# Altium schematic sheet FPGA.SCHDOC: FPGA Connections
size A2; Organization: Altium Limited.; Address1: Level 3, 12a Rodborough Rd; Address2: Frenchs Forest 2086; Address3: NSW; Address4: AUSTRALIA; DocumentNumber: 3; SheetNumber: 4; SheetTotal: 23; PageSetup: Record=PageOptions|CenterHorizontal=True|CenterVertical=True|PrintScale=0.71|XCorrection=1.00|YCorrection=1.00|PrintKind=0|BorderSize=5000000|LeftOffset=0|BottomOffset=0|Orientation=2|PaperLength=4199|PaperWidth=2969|Scale=100|PaperSource=7|PrintQuality=600|MediaType=1|DitherType=10|PaperKind=A3 (297 x 420 mm)|PrintScaleMode=1
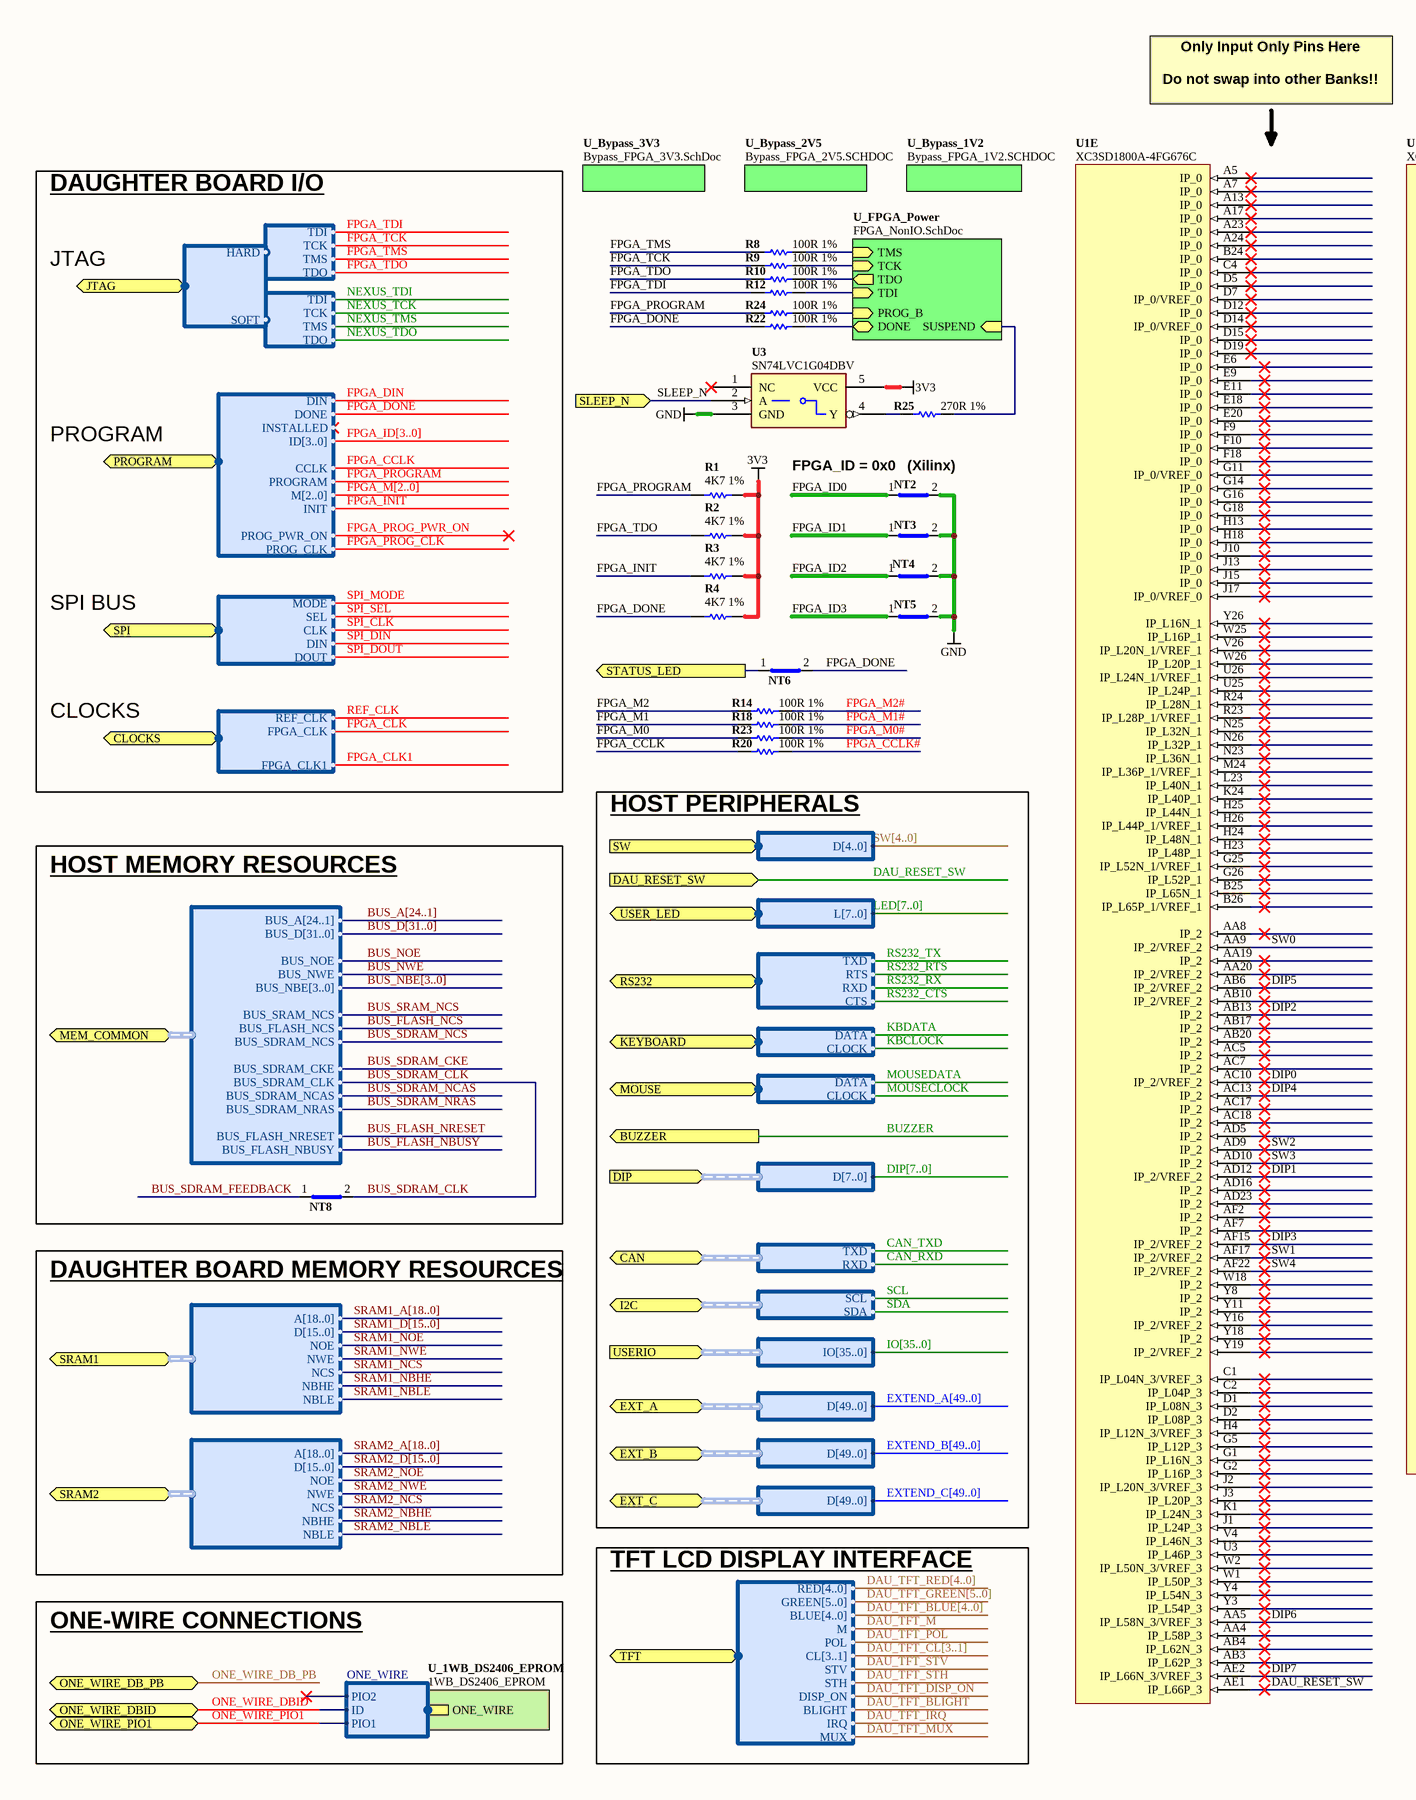
[diagram p0: FPGA.SCHDOC, left]
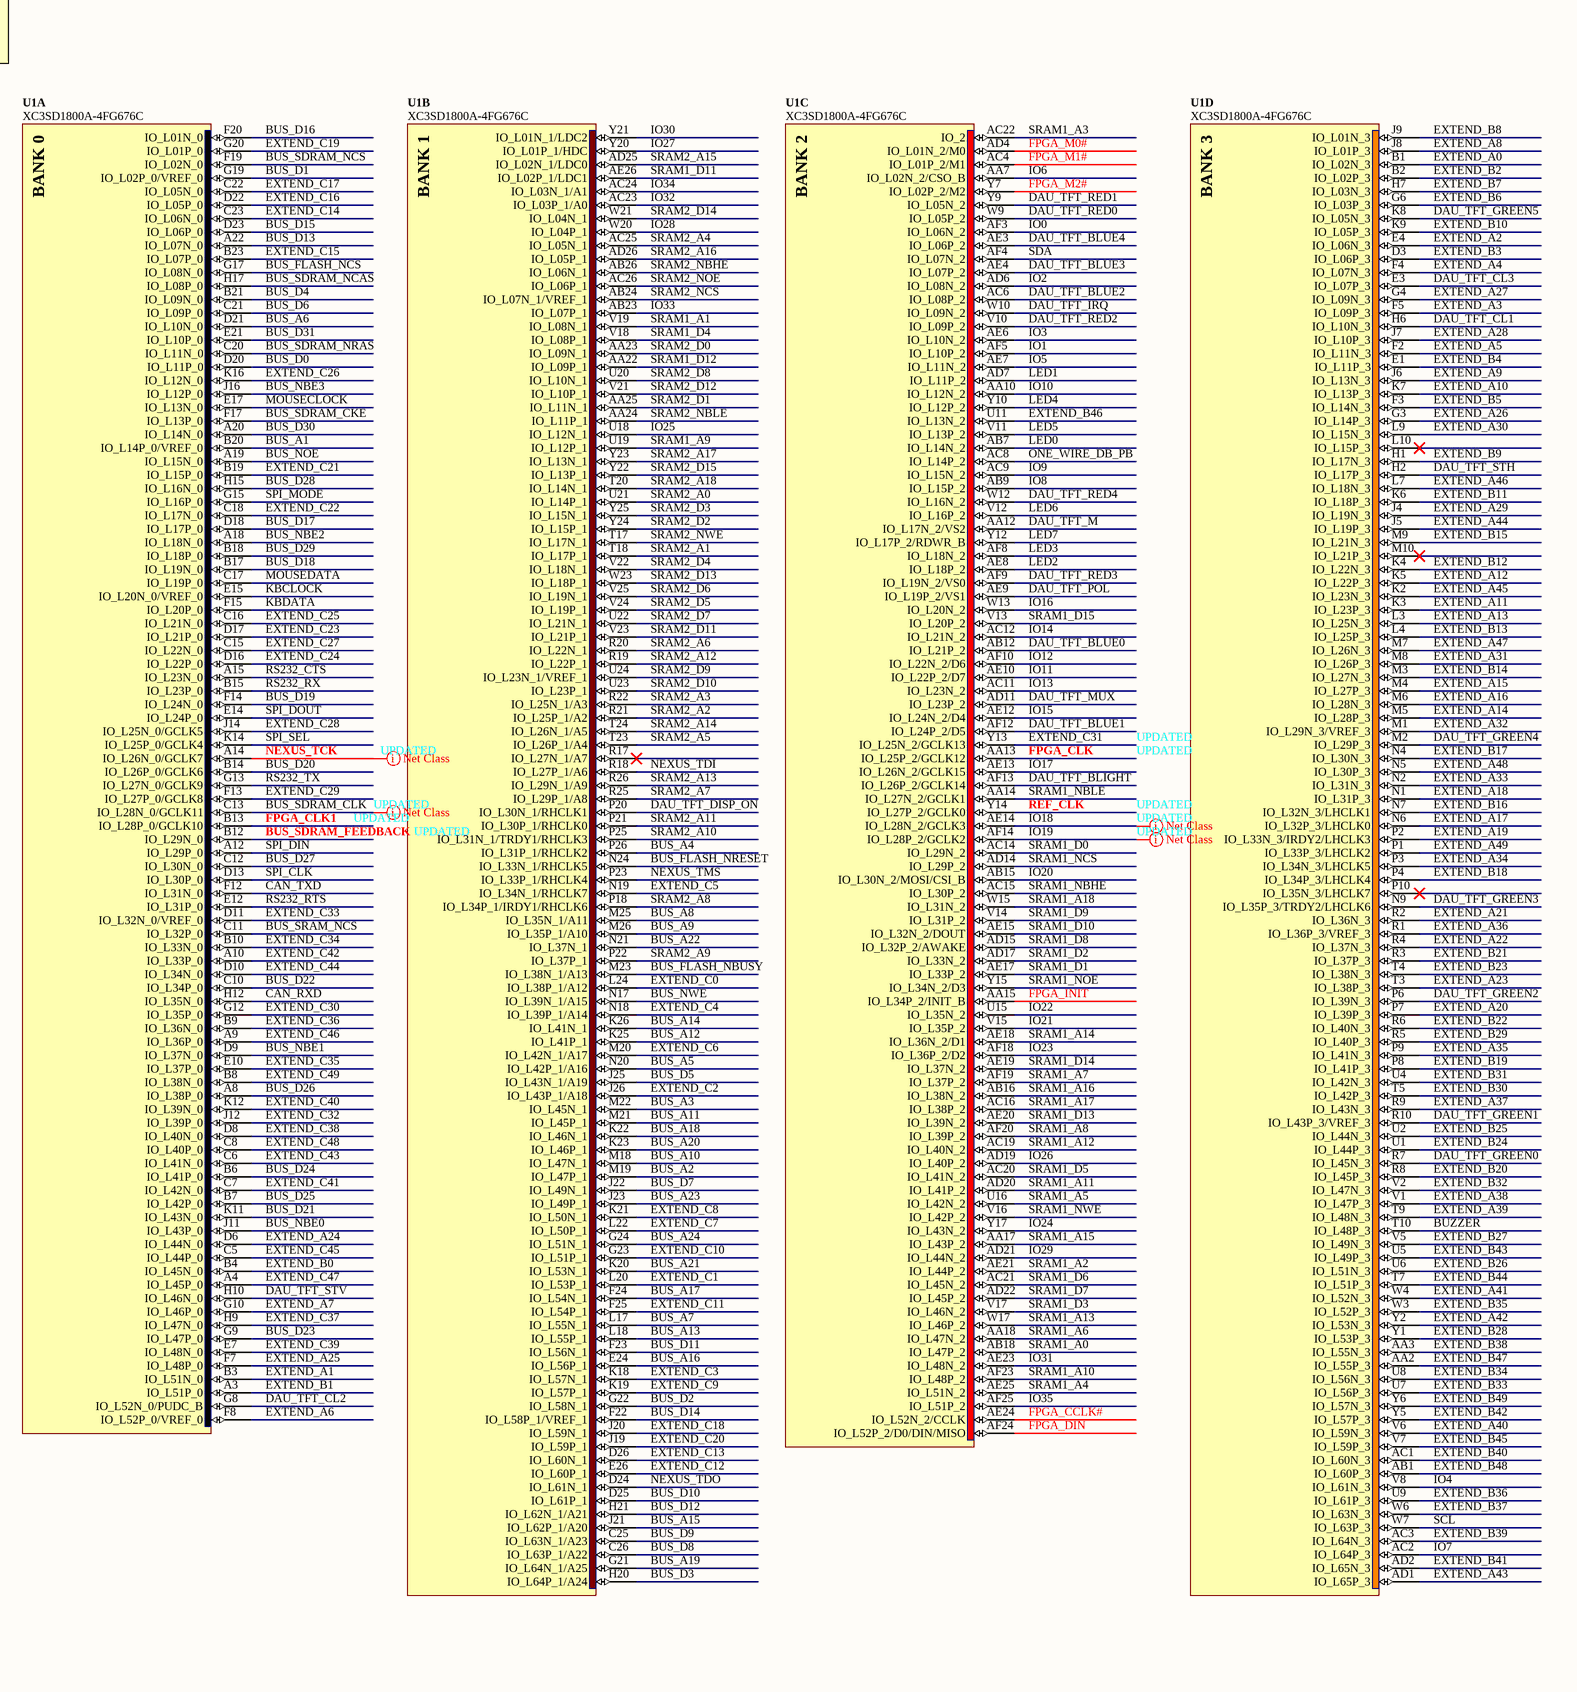
[diagram p1: FPGA.SCHDOC, right]

## Parts
NT2  Net Tie SMT2  [NETTIE-SMT2-8X8]  (value not drawn)  (net tie, no BOM)
NT3  Net Tie SMT2  [NETTIE-SMT2-8X8]  (value not drawn)  (net tie, no BOM)
NT4  Net Tie SMT2  [NETTIE-SMT2-8X8]  (value not drawn)  (net tie, no BOM)
NT5  Net Tie SMT2  [NETTIE-SMT2-8X8]  (value not drawn)  (net tie, no BOM)
NT6  Net Tie SMT2  [NETTIE-SMT2-8X8]  (value not drawn)  (net tie, no BOM)
NT8  Net Tie SMT2  [NETTIE-SMT2-8X8]  (value not drawn)  (net tie, no BOM)
R1  4K7 1%  [RESC1005-STAR]
R2  4K7 1%  [RESC1005-STAR]
R3  4K7 1%  [RESC1005-STAR]
R4  4K7 1%  [RESC1005-STAR]
R8  100R 1%  [RESC1005-STAR]
R9  100R 1%  [RESC1005-STAR]
R10  100R 1%  [RESC1005-STAR]
R12  100R 1%  [RESC1005-STAR]
R14  100R 1%  [RESC1005-STAR]
R18  100R 1%  [RESC1005-STAR]
R20  100R 1%  [RESC1005-STAR]
R22  100R 1%  [RESC1005-STAR]
R23  100R 1%  [RESC1005-STAR]
R24  100R 1%  [RESC1005-STAR]
R25  270R 1%  [RESC1005-STAR]
U1  XC3SD1800A-4FG676C  [BGA100P26X26-676]  (parts A,B,C,D,E of 8)
U3  SN74LVC1G04DBV  [SOT95P280-5]

## Blocks framed on the sheet
HOST MEMORY RESOURCES: NT8

## Sub-sheets
U_1WB_DS2406_EPROM = 1WB_DS2406_EPROM: ONE_WIRE (harness ONE_WIRE)
U_Bypass_1V2 = Bypass_FPGA_1V2.SCHDOC: no entries
U_Bypass_2V5 = Bypass_FPGA_2V5.SCHDOC: no entries
U_Bypass_3V3 = Bypass_FPGA_3V3.SchDoc: no entries
U_FPGA_Power = FPGA_NonIO.SchDoc: TMS (in), DONE (bidir), TCK (in), TDI (in), PROG_B (in), TDO (out), SUSPEND (in)

## Ports
BUZZER (out), CAN (harness CAN_INT), CLOCKS (harness DAU_CLK), DAU_RESET_SW (in), DIP (harness SW8), EXT_A (harness PBIO), EXT_B (harness PBIO), EXT_C (harness PBIO), I2C (harness I2C), JTAG (harness HARDSOFT_JTAG), KEYBOARD (harness PS2), MEM_COMMON (harness HOSTMEMORY), MOUSE (harness PS2), ONE_WIRE_DB_PB (bidir), ONE_WIRE_DBID (bidir), ONE_WIRE_PIO1 (bidir), PROGRAM (harness DAU_CTRL), RS232 (harness RS232_INT), SLEEP_N (in), SPI (harness DAU_SPI), SRAM1 (harness SRAM-256Kx16), SRAM2 (harness SRAM-256Kx16), STATUS_LED (out), SW (harness SW5), TFT (harness DAU_TFT), USER_LED (harness LED8), USERIO (harness IO36)

## Harnesses
ONE_WIRE: ID, PIO1, PIO2
SRAM-256Kx16: A[18..0], D[15..0], NCS, NWE, NOE, NBHE, NBLE
HOSTMEMORY: BUS_A[24..1], BUS_D[31..0], BUS_NOE, BUS_NWE, BUS_NBE[3..0], BUS_SRAM_NCS, BUS_FLASH_NCS, BUS_SDRAM_NCS, BUS_SDRAM_CKE, BUS_SDRAM_CLK, BUS_SDRAM_NCAS, BUS_SDRAM_NRAS, BUS_FLASH_NRESET, BUS_FLASH_NBUSY
DAU_CLK: REF_CLK, FPGA_CLK, FPGA_CLK1
DAU_SPI: MODE, SEL, CLK, DIN, DOUT
DAU_CTRL: DIN, DONE, INSTALLED, ID[3..0], CCLK, PROGRAM, M[2..0], INIT, PROG_PWR_ON, PROG_CLK
JTAG: TMS, TDO, TDI, TCK
HARDSOFT_JTAG: HARD, SOFT
LED8: L[7..0]
SW5: D[4..0]
DAU_TFT: RED[4..0], GREEN[5..0], BLUE[4..0], M, POL, CL[3..1], STV, STH, DISP_ON, BLIGHT, IRQ, MUX
PS2: DATA, CLOCK
RS232_INT: RXD, TXD, RTS, CTS
IO36: IO[35..0]
SW8: D[7..0]
CAN_INT: TXD, RXD
I2C: SCL, SDA
PBIO: D[49..0]

## Nets
3V3: R1.2 R2.2 R3.2 R4.2 U3.5(VCC)
GND: NT2.2(Net2) NT3.2(Net2) NT4.2(Net2) NT5.2(Net2) U3.3(GND)
BUS_A1: U1.B20(IO_L14P_0/VREF_0)
BUS_A2: U1.M19(IO_L47P_1)
BUS_A3: U1.M22(IO_L45N_1)
BUS_A4: U1.P26(IO_L31P_1/RHCLK2)
BUS_A5: U1.N20(IO_L42P_1/A16)
BUS_A6: U1.D21(IO_L10N_0)
BUS_A7: U1.L17(IO_L55N_1)
BUS_A8: U1.M25(IO_L35N_1/A11)
BUS_A9: U1.M26(IO_L35P_1/A10)
BUS_A10: U1.M18(IO_L47N_1)
BUS_A11: U1.M21(IO_L45P_1)
BUS_A12: U1.K25(IO_L41P_1)
BUS_A13: U1.L18(IO_L55P_1)
BUS_A14: U1.K26(IO_L41N_1)
BUS_A15: U1.J21(IO_L62P_1/A20)
BUS_A16: U1.E24(IO_L56P_1)
BUS_A17: U1.F24(IO_L54N_1)
BUS_A18: U1.K22(IO_L46N_1)
BUS_A19: U1.G21(IO_L64N_1/A25)
BUS_A20: U1.K23(IO_L46P_1)
BUS_A21: U1.K20(IO_L53N_1)
BUS_A22: U1.N21(IO_L37N_1)
BUS_A23: U1.J23(IO_L49P_1)
BUS_A24: U1.G24(IO_L51N_1)
BUS_D0: U1.D20(IO_L11P_0)
BUS_D1: U1.G19(IO_L02P_0/VREF_0)
BUS_D2: U1.G22(IO_L58N_1)
BUS_D3: U1.H20(IO_L64P_1/A24)
BUS_D4: U1.B21(IO_L09N_0)
BUS_D5: U1.J25(IO_L43N_1/A19)
BUS_D6: U1.C21(IO_L09P_0)
BUS_D7: U1.J22(IO_L49N_1)
BUS_D8: U1.C26(IO_L63P_1/A22)
BUS_D9: U1.C25(IO_L63N_1/A23)
BUS_D10: U1.D25(IO_L61P_1)
BUS_D11: U1.F23(IO_L56N_1)
BUS_D12: U1.H21(IO_L62N_1/A21)
BUS_D13: U1.A22(IO_L07N_0)
BUS_D14: U1.F22(IO_L58P_1/VREF_1)
BUS_D15: U1.D23(IO_L06P_0)
BUS_D16: U1.F20(IO_L01N_0)
BUS_D17: U1.D18(IO_L17P_0)
BUS_D18: U1.B17(IO_L19N_0)
BUS_D19: U1.F14(IO_L24N_0)
BUS_D20: U1.B14(IO_L26P_0/GCLK6)
BUS_D21: U1.K11(IO_L43N_0)
BUS_D22: U1.C10(IO_L34P_0)
BUS_D23: U1.G9(IO_L47P_0)
BUS_D24: U1.B6(IO_L41P_0)
BUS_D25: U1.B7(IO_L42P_0)
BUS_D26: U1.A8(IO_L38P_0)
BUS_D27: U1.C12(IO_L30N_0)
BUS_D28: U1.H15(IO_L16N_0)
BUS_D29: U1.B18(IO_L18P_0)
BUS_D30: U1.A20(IO_L14N_0)
BUS_D31: U1.E21(IO_L10P_0)
BUS_FLASH_NBUSY: U1.M23(IO_L38N_1/A13) ; port MEM_COMMON.BUS_FLASH_NBUSY
BUS_FLASH_NCS: U1.G17(IO_L08N_0) ; port MEM_COMMON.BUS_FLASH_NCS
BUS_FLASH_NRESET: U1.N24(IO_L33N_1/RHCLK5) ; port MEM_COMMON.BUS_FLASH_NRESET
BUS_NBE0: U1.J11(IO_L43P_0)
BUS_NBE1: U1.D9(IO_L37N_0)
BUS_NBE2: U1.A18(IO_L18N_0)
BUS_NBE3: U1.J16(IO_L12P_0)
BUS_NOE: U1.A19(IO_L15N_0) ; port MEM_COMMON.BUS_NOE
BUS_NWE: U1.N17(IO_L39N_1/A15) ; port MEM_COMMON.BUS_NWE
BUS_SDRAM_CKE: U1.F17(IO_L13P_0) ; port MEM_COMMON.BUS_SDRAM_CKE
BUS_SDRAM_CLK: NT8.2(Net2) U1.C13(IO_L28N_0/GCLK11) ; port MEM_COMMON.BUS_SDRAM_CLK
BUS_SDRAM_FEEDBACK: NT8.1(Net1) U1.B12(IO_L29N_0)
BUS_SDRAM_NCAS: U1.H17(IO_L08P_0) ; port MEM_COMMON.BUS_SDRAM_NCAS
BUS_SDRAM_NCS: U1.F19(IO_L02N_0) ; port MEM_COMMON.BUS_SDRAM_NCS
BUS_SDRAM_NRAS: U1.C20(IO_L11N_0) ; port MEM_COMMON.BUS_SDRAM_NRAS
BUS_SRAM_NCS: U1.C11(IO_L32P_0) ; port MEM_COMMON.BUS_SRAM_NCS
BUZZER: U1.T10(IO_L48P_3) ; port BUZZER
CAN_RXD: U1.H12(IO_L35N_0) ; port CAN.RXD
CAN_TXD: U1.F12(IO_L31N_0) ; port CAN.TXD
DAU_RESET_SW: U1.AE1(IP_L66P_3) ; port DAU_RESET_SW
DAU_TFT_BLIGHT: U1.AF13(IO_L26P_2/GCLK14) ; port TFT.BLIGHT
DAU_TFT_BLUE0: U1.AB12(IO_L21P_2)
DAU_TFT_BLUE1: U1.AF12(IO_L24P_2/D5)
DAU_TFT_BLUE2: U1.AC6(IO_L08P_2)
DAU_TFT_BLUE3: U1.AE4(IO_L07P_2)
DAU_TFT_BLUE4: U1.AE3(IO_L06P_2)
DAU_TFT_CL1: U1.H6(IO_L10N_3)
DAU_TFT_CL2: U1.G8(IO_L52N_0/PUDC_B)
DAU_TFT_CL3: U1.E3(IO_L07P_3)
DAU_TFT_DISP_ON: U1.P20(IO_L30N_1/RHCLK1) ; port TFT.DISP_ON
DAU_TFT_GREEN0: U1.R7(IO_L45N_3)
DAU_TFT_GREEN1: U1.R10(IO_L43P_3/VREF_3)
DAU_TFT_GREEN2: U1.P6(IO_L39N_3)
DAU_TFT_GREEN3: U1.N9(IO_L35P_3/TRDY2/LHCLK6)
DAU_TFT_GREEN4: U1.M2(IO_L29P_3)
DAU_TFT_GREEN5: U1.K8(IO_L05N_3)
DAU_TFT_IRQ: U1.W10(IO_L09N_2) ; port TFT.IRQ
DAU_TFT_M: U1.AA12(IO_L17N_2/VS2) ; port TFT.M
DAU_TFT_MUX: U1.AD11(IO_L23P_2) ; port TFT.MUX
DAU_TFT_POL: U1.AE9(IO_L19P_2/VS1) ; port TFT.POL
DAU_TFT_RED0: U1.W9(IO_L05P_2)
DAU_TFT_RED1: U1.Y9(IO_L05N_2)
DAU_TFT_RED2: U1.V10(IO_L09P_2)
DAU_TFT_RED3: U1.AF9(IO_L19N_2/VS0)
DAU_TFT_RED4: U1.W12(IO_L16N_2)
DAU_TFT_STH: U1.H2(IO_L17P_3) ; port TFT.STH
DAU_TFT_STV: U1.H10(IO_L46N_0) ; port TFT.STV
DIP0: U1.AC10(IP_2/VREF_2)
DIP1: U1.AD12(IP_2/VREF_2)
DIP2: U1.AB13(IP_2)
DIP3: U1.AF15(IP_2/VREF_2)
DIP4: U1.AC13(IP_2)
DIP5: U1.AB6(IP_2/VREF_2)
DIP6: U1.AA5(IP_L58N_3/VREF_3)
DIP7: U1.AE2(IP_L66N_3/VREF_3)
EXTEND_A0: U1.B1(IO_L02N_3)
EXTEND_A1: U1.B3(IO_L51N_0)
EXTEND_A2: U1.E4(IO_L06N_3)
EXTEND_A3: U1.F5(IO_L09P_3)
EXTEND_A4: U1.F4(IO_L07N_3)
EXTEND_A5: U1.F2(IO_L11N_3)
EXTEND_A6: U1.F8(IO_L52P_0/VREF_0)
EXTEND_A7: U1.G10(IO_L46P_0)
EXTEND_A8: U1.J8(IO_L01P_3)
EXTEND_A9: U1.J6(IO_L13N_3)
EXTEND_A10: U1.K7(IO_L13P_3)
EXTEND_A11: U1.K3(IO_L23P_3)
EXTEND_A12: U1.K5(IO_L22P_3)
EXTEND_A13: U1.L3(IO_L25N_3)
EXTEND_A14: U1.M5(IO_L28P_3)
EXTEND_A15: U1.M4(IO_L27P_3)
EXTEND_A16: U1.M6(IO_L28N_3)
EXTEND_A17: U1.N6(IO_L32P_3/LHCLK0)
EXTEND_A18: U1.N1(IO_L31P_3)
EXTEND_A19: U1.P2(IO_L33N_3/IRDY2/LHCLK3)
EXTEND_A20: U1.P7(IO_L39P_3)
EXTEND_A21: U1.R2(IO_L36N_3)
EXTEND_A22: U1.R4(IO_L37N_3)
EXTEND_A23: U1.T3(IO_L38P_3)
EXTEND_A24: U1.D6(IO_L44N_0)
EXTEND_A25: U1.F7(IO_L48P_0)
EXTEND_A26: U1.G3(IO_L14P_3)
EXTEND_A27: U1.G4(IO_L09N_3)
EXTEND_A28: U1.J7(IO_L10P_3)
EXTEND_A29: U1.J4(IO_L19N_3)
EXTEND_A30: U1.L9(IO_L15N_3)
EXTEND_A31: U1.M8(IO_L26P_3)
EXTEND_A32: U1.M1(IO_L29N_3/VREF_3)
EXTEND_A33: U1.N2(IO_L31N_3)
EXTEND_A34: U1.P3(IO_L34N_3/LHCLK5)
EXTEND_A35: U1.P9(IO_L41N_3)
EXTEND_A36: U1.R1(IO_L36P_3/VREF_3)
EXTEND_A37: U1.R9(IO_L43N_3)
EXTEND_A38: U1.V1(IO_L47P_3)
EXTEND_A39: U1.T9(IO_L48N_3)
EXTEND_A40: U1.V6(IO_L59N_3)
EXTEND_A41: U1.W4(IO_L52N_3)
EXTEND_A42: U1.Y2(IO_L53N_3)
EXTEND_A43: U1.AD1(IO_L65P_3)
EXTEND_A44: U1.J5(IO_L19P_3)
EXTEND_A45: U1.K2(IO_L23N_3)
EXTEND_A46: U1.L7(IO_L18N_3)
EXTEND_A47: U1.M7(IO_L26N_3)
EXTEND_A48: U1.N5(IO_L30P_3)
EXTEND_A49: U1.P1(IO_L33P_3/LHCLK2)
EXTEND_B0: U1.B4(IO_L45N_0)
EXTEND_B1: U1.A3(IO_L51P_0)
EXTEND_B2: U1.B2(IO_L02P_3)
EXTEND_B3: U1.D3(IO_L06P_3)
EXTEND_B4: U1.E1(IO_L11P_3)
EXTEND_B5: U1.F3(IO_L14N_3)
EXTEND_B6: U1.G6(IO_L03P_3)
EXTEND_B7: U1.H7(IO_L03N_3)
EXTEND_B8: U1.J9(IO_L01N_3)
EXTEND_B9: U1.H1(IO_L17N_3)
EXTEND_B10: U1.K9(IO_L05P_3)
EXTEND_B11: U1.K6(IO_L18P_3)
EXTEND_B12: U1.K4(IO_L22N_3)
EXTEND_B13: U1.L4(IO_L25P_3)
EXTEND_B14: U1.M3(IO_L27N_3)
EXTEND_B15: U1.M9(IO_L21N_3)
EXTEND_B16: U1.N7(IO_L32N_3/LHCLK1)
EXTEND_B17: U1.N4(IO_L30N_3)
EXTEND_B18: U1.P4(IO_L34P_3/LHCLK4)
EXTEND_B19: U1.P8(IO_L41P_3)
EXTEND_B20: U1.R8(IO_L45P_3)
EXTEND_B21: U1.R3(IO_L37P_3)
EXTEND_B22: U1.R6(IO_L40N_3)
EXTEND_B23: U1.T4(IO_L38N_3)
EXTEND_B24: U1.U1(IO_L44P_3)
EXTEND_B25: U1.U2(IO_L44N_3)
EXTEND_B26: U1.U6(IO_L51N_3)
EXTEND_B27: U1.V5(IO_L49N_3)
EXTEND_B28: U1.Y1(IO_L53P_3)
EXTEND_B29: U1.R5(IO_L40P_3)
EXTEND_B30: U1.T5(IO_L42P_3)
EXTEND_B31: U1.U4(IO_L42N_3)
EXTEND_B32: U1.V2(IO_L47N_3)
EXTEND_B33: U1.U7(IO_L56P_3)
EXTEND_B34: U1.U8(IO_L56N_3)
EXTEND_B35: U1.W3(IO_L52P_3)
EXTEND_B36: U1.U9(IO_L61P_3)
EXTEND_B37: U1.W6(IO_L63N_3)
EXTEND_B38: U1.AA3(IO_L55N_3)
EXTEND_B39: U1.AC3(IO_L64N_3)
EXTEND_B40: U1.AC1(IO_L60N_3)
EXTEND_B41: U1.AD2(IO_L65N_3)
EXTEND_B42: U1.Y5(IO_L57P_3)
EXTEND_B43: U1.U5(IO_L49P_3)
EXTEND_B44: U1.T7(IO_L51P_3)
EXTEND_B45: U1.V7(IO_L59P_3)
EXTEND_B46: U1.U11(IO_L13N_2)
EXTEND_B47: U1.AA2(IO_L55P_3)
EXTEND_B48: U1.AB1(IO_L60P_3)
EXTEND_B49: U1.Y6(IO_L57N_3)
EXTEND_C0: U1.L24(IO_L38P_1/A12)
EXTEND_C1: U1.L20(IO_L53P_1)
EXTEND_C2: U1.J26(IO_L43P_1/A18)
EXTEND_C3: U1.K18(IO_L57N_1)
EXTEND_C4: U1.N18(IO_L39P_1/A14)
EXTEND_C5: U1.N19(IO_L34N_1/RHCLK7)
EXTEND_C6: U1.M20(IO_L42N_1/A17)
EXTEND_C7: U1.L22(IO_L50P_1)
EXTEND_C8: U1.K21(IO_L50N_1)
EXTEND_C9: U1.K19(IO_L57P_1)
EXTEND_C10: U1.G23(IO_L51P_1)
EXTEND_C11: U1.F25(IO_L54P_1)
EXTEND_C12: U1.E26(IO_L60P_1)
EXTEND_C13: U1.D26(IO_L60N_1)
EXTEND_C14: U1.C23(IO_L06N_0)
EXTEND_C15: U1.B23(IO_L07P_0)
EXTEND_C16: U1.D22(IO_L05P_0)
EXTEND_C17: U1.C22(IO_L05N_0)
EXTEND_C18: U1.J20(IO_L59N_1)
EXTEND_C19: U1.G20(IO_L01P_0)
EXTEND_C20: U1.J19(IO_L59P_1)
EXTEND_C21: U1.B19(IO_L15P_0)
EXTEND_C22: U1.C18(IO_L17N_0)
EXTEND_C23: U1.D17(IO_L21P_0)
EXTEND_C24: U1.D16(IO_L22P_0)
EXTEND_C25: U1.C16(IO_L21N_0)
EXTEND_C26: U1.K16(IO_L12N_0)
EXTEND_C27: U1.C15(IO_L22N_0)
EXTEND_C28: U1.J14(IO_L25N_0/GCLK5)
EXTEND_C29: U1.F13(IO_L27P_0/GCLK8)
EXTEND_C30: U1.G12(IO_L35P_0)
EXTEND_C31: U1.Y13(IO_L25N_2/GCLK13)
EXTEND_C32: U1.J12(IO_L39P_0)
EXTEND_C33: U1.D11(IO_L32N_0/VREF_0)
EXTEND_C34: U1.B10(IO_L33N_0)
EXTEND_C35: U1.E10(IO_L37P_0)
EXTEND_C36: U1.B9(IO_L36N_0)
EXTEND_C37: U1.H9(IO_L47N_0)
EXTEND_C38: U1.D8(IO_L40N_0)
EXTEND_C39: U1.E7(IO_L48N_0)
EXTEND_C40: U1.K12(IO_L39N_0)
EXTEND_C41: U1.C7(IO_L42N_0)
EXTEND_C42: U1.A10(IO_L33P_0)
EXTEND_C43: U1.C6(IO_L41N_0)
EXTEND_C44: U1.D10(IO_L34N_0)
EXTEND_C45: U1.C5(IO_L44P_0)
EXTEND_C46: U1.A9(IO_L36P_0)
EXTEND_C47: U1.A4(IO_L45P_0)
EXTEND_C48: U1.C8(IO_L40P_0)
EXTEND_C49: U1.B8(IO_L38N_0)
FPGA_CCLK: R20.1 ; port PROGRAM.CCLK
FPGA_CCLK#: R20.2 U1.AE24(IO_L52N_2/CCLK)
FPGA_CLK: U1.AA13(IO_L25P_2/GCLK12) ; port CLOCKS.FPGA_CLK
FPGA_CLK1: U1.B13(IO_L28P_0/GCLK10) ; port CLOCKS.FPGA_CLK1
FPGA_DIN: U1.AF24(IO_L52P_2/D0/DIN/MISO) ; port PROGRAM.DIN
FPGA_DONE: NT6.2(Net2) R4.1 R22.1 ; port PROGRAM.DONE
FPGA_ID0: NT2.1(Net1)
FPGA_ID1: NT3.1(Net1)
FPGA_ID2: NT4.1(Net1)
FPGA_ID3: NT5.1(Net1)
FPGA_INIT: R3.1 U1.AA15(IO_L34P_2/INIT_B) ; port PROGRAM.INIT
FPGA_M0: R23.1
FPGA_M0#: R23.2 U1.AD4(IO_L01N_2/M0)
FPGA_M1: R18.1
FPGA_M1#: R18.2 U1.AC4(IO_L01P_2/M1)
FPGA_M2: R14.1
FPGA_M2#: R14.2 U1.Y7(IO_L02P_2/M2)
FPGA_PROG_CLK: port PROGRAM.PROG_CLK
FPGA_PROG_PWR_ON: port PROGRAM.PROG_PWR_ON
FPGA_PROGRAM: R1.1 R24.1 ; port PROGRAM.PROGRAM
FPGA_TCK: R9.1 ; harness JTAG.TCK
FPGA_TDI: R12.1 ; harness JTAG.TDI
FPGA_TDO: R2.1 R10.1 ; harness JTAG.TDO
FPGA_TMS: R8.1 ; harness JTAG.TMS
IO0: U1.AF3(IO_L06N_2)
IO1: U1.AF5(IO_L10P_2)
IO2: U1.AD6(IO_L08N_2)
IO3: U1.AE6(IO_L10N_2)
IO4: U1.V8(IO_L61N_3)
IO5: U1.AE7(IO_L11N_2)
IO6: U1.AA7(IO_L02N_2/CSO_B)
IO7: U1.AC2(IO_L64P_3)
IO8: U1.AB9(IO_L15P_2)
IO9: U1.AC9(IO_L15N_2)
IO10: U1.AA10(IO_L12N_2)
IO11: U1.AE10(IO_L22P_2/D7)
IO12: U1.AF10(IO_L22N_2/D6)
IO13: U1.AC11(IO_L23N_2)
IO14: U1.AC12(IO_L21N_2)
IO15: U1.AE12(IO_L24N_2/D4)
IO16: U1.W13(IO_L20N_2)
IO17: U1.AE13(IO_L26N_2/GCLK15)
IO18: U1.AE14(IO_L28N_2/GCLK3)
IO19: U1.AF14(IO_L28P_2/GCLK2)
IO20: U1.AB15(IO_L30N_2/MOSI/CSI_B)
IO21: U1.V15(IO_L35P_2)
IO22: U1.U15(IO_L35N_2)
IO23: U1.AF18(IO_L36P_2/D2)
IO24: U1.Y17(IO_L43N_2)
IO25: U1.U18(IO_L12N_1)
IO26: U1.AD19(IO_L40P_2)
IO27: U1.Y20(IO_L01P_1/HDC)
IO28: U1.W20(IO_L04P_1)
IO29: U1.AD21(IO_L44N_2)
IO30: U1.Y21(IO_L01N_1/LDC2)
IO31: U1.AE23(IO_L48N_2)
IO32: U1.AC23(IO_L03P_1/A0)
IO33: U1.AB23(IO_L07P_1)
IO34: U1.AC24(IO_L03N_1/A1)
IO35: U1.AF25(IO_L51P_2)
KBCLOCK: U1.E15(IO_L20N_0/VREF_0) ; port KEYBOARD.CLOCK
KBDATA: U1.F15(IO_L20P_0) ; port KEYBOARD.DATA
LED0: U1.AB7(IO_L14N_2)
LED1: U1.AD7(IO_L11P_2)
LED2: U1.AE8(IO_L18P_2)
LED3: U1.AF8(IO_L18N_2)
LED4: U1.Y10(IO_L12P_2)
LED5: U1.V11(IO_L13P_2)
LED6: U1.V12(IO_L16P_2)
LED7: U1.Y12(IO_L17P_2/RDWR_B)
MOUSECLOCK: U1.E17(IO_L13N_0) ; port MOUSE.CLOCK
MOUSEDATA: U1.C17(IO_L19P_0) ; port MOUSE.DATA
NEXUS_TCK: U1.A14(IO_L26N_0/GCLK7) ; harness JTAG.TCK
NEXUS_TDI: U1.R18(IO_L27P_1/A6) ; harness JTAG.TDI
NEXUS_TDO: U1.D24(IO_L61N_1) ; harness JTAG.TDO
NEXUS_TMS: U1.P23(IO_L33P_1/RHCLK4) ; harness JTAG.TMS
ONE_WIRE_DB_PB: U1.AC8(IO_L14P_2) ; port ONE_WIRE_DB_PB
ONE_WIRE_DBID: port ONE_WIRE_DBID, sheet U_1WB_DS2406_EPROM/ONE_WIRE.ID
ONE_WIRE_PIO1: port ONE_WIRE_PIO1, sheet U_1WB_DS2406_EPROM/ONE_WIRE.PIO1
REF_CLK: U1.Y14(IO_L27P_2/GCLK0) ; port CLOCKS.REF_CLK
RS232_CTS: U1.A15(IO_L23N_0) ; port RS232.CTS
RS232_RTS: U1.E12(IO_L31P_0) ; port RS232.RTS
RS232_RX: U1.B15(IO_L23P_0) ; port RS232.RXD
RS232_TX: U1.G13(IO_L27N_0/GCLK9) ; port RS232.TXD
SCL: U1.W7(IO_L63P_3) ; port I2C.SCL
SDA: U1.AF4(IO_L07N_2) ; port I2C.SDA
SLEEP_N: U3.2(A) ; port SLEEP_N
SPI_CLK: U1.D13(IO_L30P_0) ; port SPI.CLK
SPI_DIN: U1.A12(IO_L29P_0) ; port SPI.DIN
SPI_DOUT: U1.E14(IO_L24P_0) ; port SPI.DOUT
SPI_MODE: U1.G15(IO_L16P_0) ; port SPI.MODE
SPI_SEL: U1.K14(IO_L25P_0/GCLK4) ; port SPI.SEL
SRAM1_A0: U1.AB18(IO_L47P_2)
SRAM1_A1: U1.V19(IO_L08N_1)
SRAM1_A2: U1.AE21(IO_L44P_2)
SRAM1_A3: U1.AC22(IO_2)
SRAM1_A4: U1.AE25(IO_L51N_2)
SRAM1_A5: U1.U16(IO_L42N_2)
SRAM1_A6: U1.AA18(IO_L47N_2)
SRAM1_A7: U1.AF19(IO_L37P_2)
SRAM1_A8: U1.AF20(IO_L39P_2)
SRAM1_A9: U1.U19(IO_L12P_1)
SRAM1_A10: U1.AF23(IO_L48P_2)
SRAM1_A11: U1.AD20(IO_L41P_2)
SRAM1_A12: U1.AC19(IO_L40N_2)
SRAM1_A13: U1.W17(IO_L46P_2)
SRAM1_A14: U1.AE18(IO_L36N_2/D1)
SRAM1_A15: U1.AA17(IO_L43P_2)
SRAM1_A16: U1.AB16(IO_L38N_2)
SRAM1_A17: U1.AC16(IO_L38P_2)
SRAM1_A18: U1.W15(IO_L31N_2)
SRAM1_D0: U1.AC14(IO_L29N_2)
SRAM1_D1: U1.AE17(IO_L33P_2)
SRAM1_D2: U1.AD17(IO_L33N_2)
SRAM1_D3: U1.V17(IO_L46N_2)
SRAM1_D4: U1.V18(IO_L08P_1)
SRAM1_D5: U1.AC20(IO_L41N_2)
SRAM1_D6: U1.AC21(IO_L45N_2)
SRAM1_D7: U1.AD22(IO_L45P_2)
SRAM1_D8: U1.AD15(IO_L32P_2/AWAKE)
SRAM1_D9: U1.V14(IO_L31P_2)
SRAM1_D10: U1.AE15(IO_L32N_2/DOUT)
SRAM1_D11: U1.AE26(IO_L02P_1/LDC1)
SRAM1_D12: U1.AA22(IO_L09P_1)
SRAM1_D13: U1.AE20(IO_L39N_2)
SRAM1_D14: U1.AE19(IO_L37N_2)
SRAM1_D15: U1.V13(IO_L20P_2)
SRAM1_NBHE: U1.AC15(IO_L30P_2) ; port SRAM1.NBHE
SRAM1_NBLE: U1.AA14(IO_L27N_2/GCLK1) ; port SRAM1.NBLE
SRAM1_NCS: U1.AD14(IO_L29P_2) ; port SRAM1.NCS
SRAM1_NOE: U1.Y15(IO_L34N_2/D3) ; port SRAM1.NOE
SRAM1_NWE: U1.V16(IO_L42P_2) ; port SRAM1.NWE
SRAM2_A0: U1.U21(IO_L14P_1)
SRAM2_A1: U1.T18(IO_L17P_1)
SRAM2_A2: U1.R21(IO_L25P_1/A2)
SRAM2_A3: U1.R22(IO_L25N_1/A3)
SRAM2_A4: U1.AC25(IO_L05N_1)
SRAM2_A5: U1.T23(IO_L26P_1/A4)
SRAM2_A6: U1.R20(IO_L22N_1)
SRAM2_A7: U1.R25(IO_L29P_1/A8)
SRAM2_A8: U1.P18(IO_L34P_1/IRDY1/RHCLK6)
SRAM2_A9: U1.P22(IO_L37P_1)
SRAM2_A10: U1.P25(IO_L31N_1/TRDY1/RHCLK3)
SRAM2_A11: U1.P21(IO_L30P_1/RHCLK0)
SRAM2_A12: U1.R19(IO_L22P_1)
SRAM2_A13: U1.R26(IO_L29N_1/A9)
SRAM2_A14: U1.T24(IO_L26N_1/A5)
SRAM2_A15: U1.AD25(IO_L02N_1/LDC0)
SRAM2_A16: U1.AD26(IO_L05P_1)
SRAM2_A17: U1.Y23(IO_L13N_1)
SRAM2_A18: U1.T20(IO_L14N_1)
SRAM2_D0: U1.AA23(IO_L09N_1)
SRAM2_D1: U1.AA25(IO_L11N_1)
SRAM2_D2: U1.Y24(IO_L15P_1)
SRAM2_D3: U1.Y25(IO_L15N_1)
SRAM2_D4: U1.V22(IO_L18N_1)
SRAM2_D5: U1.V24(IO_L19P_1)
SRAM2_D6: U1.V25(IO_L19N_1)
SRAM2_D7: U1.U22(IO_L21N_1)
SRAM2_D8: U1.U20(IO_L10N_1)
SRAM2_D9: U1.U24(IO_L23N_1/VREF_1)
SRAM2_D10: U1.U23(IO_L23P_1)
SRAM2_D11: U1.V23(IO_L21P_1)
SRAM2_D12: U1.V21(IO_L10P_1)
SRAM2_D13: U1.W23(IO_L18P_1)
SRAM2_D14: U1.W21(IO_L04N_1)
SRAM2_D15: U1.Y22(IO_L13P_1)
SRAM2_NBHE: U1.AB26(IO_L06N_1) ; port SRAM2.NBHE
SRAM2_NBLE: U1.AA24(IO_L11P_1) ; port SRAM2.NBLE
SRAM2_NCS: U1.AB24(IO_L07N_1/VREF_1) ; port SRAM2.NCS
SRAM2_NOE: U1.AC26(IO_L06P_1) ; port SRAM2.NOE
SRAM2_NWE: U1.T17(IO_L17N_1) ; port SRAM2.NWE
STATUS_LED: NT6.1(Net1) ; port STATUS_LED
SW0: U1.AA9(IP_2/VREF_2)
SW1: U1.AF17(IP_2/VREF_2)
SW2: U1.AD9(IP_2)
SW3: U1.AD10(IP_2)
SW4: U1.AF22(IP_2/VREF_2)
NetR8_2: R8.2 ; sheet U_FPGA_Power/TMS
NetR9_2: R9.2 ; sheet U_FPGA_Power/TCK
NetR10_2: R10.2 ; sheet U_FPGA_Power/TDO
NetR12_2: R12.2 ; sheet U_FPGA_Power/TDI
NetR22_2: R22.2 ; sheet U_FPGA_Power/DONE
NetR24_2: R24.2 ; sheet U_FPGA_Power/PROG_B
NetR25_1: R25.1 U3.4(Y)
NetR25_2: R25.2 ; sheet U_FPGA_Power/SUSPEND

Not connected (* = marked no-connect by the designer): U1 A5(IP_0)* A7(IP_0)* A13(IP_0)* A17(IP_0)* A23(IP_0)* A24(IP_0)* AA4(IP_L58P_3)* AA8(IP_2)* AA19(IP_2)* AA20(IP_2/VREF_2)* AB3(IP_L62P_3)* AB4(IP_L62N_3)* AB10(IP_2/VREF_2)* AB17(IP_2)* AB20(IP_2)* AC5(IP_2)* AC7(IP_2)* AC17(IP_2)* AC18(IP_2)* AD5(IP_2)* AD16(IP_2)* AD23(IP_2)* AF2(IP_2)* AF7(IP_2)* B24(IP_0)* B25(IP_L65N_1)* B26(IP_L65P_1/VREF_1)* C1(IP_L04N_3/VREF_3)* C2(IP_L04P_3)* C4(IP_0)* D1(IP_L08N_3)* D2(IP_L08P_3)* D5(IP_0)* D7(IP_0/VREF_0)* D12(IP_0)* D14(IP_0/VREF_0)* D15(IP_0)* D19(IP_0)* E6(IP_0)* E9(IP_0)* E11(IP_0)* E18(IP_0)* E20(IP_0)* F9(IP_0)* F10(IP_0)* F18(IP_0)* G1(IP_L16N_3)* G2(IP_L16P_3)* G5(IP_L12P_3)* G11(IP_0/VREF_0)* G14(IP_0)* G16(IP_0)* G18(IP_0)* G25(IP_L52N_1/VREF_1)* G26(IP_L52P_1)* H4(IP_L12N_3/VREF_3)* H13(IP_0)* H18(IP_0)* H23(IP_L48P_1)* H24(IP_L48N_1)* H25(IP_L44N_1)* H26(IP_L44P_1/VREF_1)* J1(IP_L24P_3)* J2(IP_L20N_3/VREF_3)* J3(IP_L20P_3)* J10(IP_0)* J13(IP_0)* J15(IP_0)* J17(IP_0/VREF_0)* K1(IP_L24N_3)* K24(IP_L40P_1)* L10(IO_L15P_3)* L23(IP_L40N_1)* M10(IO_L21P_3)* M24(IP_L36P_1/VREF_1)* N23(IP_L36N_1)* N25(IP_L32N_1)* N26(IP_L32P_1)* P10(IO_L35N_3/LHCLK7)* R17(IO_L27N_1/A7)* R23(IP_L28P_1/VREF_1)* R24(IP_L28N_1)* U3(IP_L46P_3)* U25(IP_L24P_1)* U26(IP_L24N_1/VREF_1)* V4(IP_L46N_3)* V26(IP_L20N_1/VREF_1)* W1(IP_L50P_3)* W2(IP_L50N_3/VREF_3)* W18(IP_2)* W25(IP_L16P_1)* W26(IP_L20P_1)* Y3(IP_L54P_3)* Y4(IP_L54N_3)* Y8(IP_2)* Y11(IP_2)* Y16(IP_2/VREF_2)* Y18(IP_2)* Y19(IP_2/VREF_2)* Y26(IP_L16N_1)*; U3 1(NC)*

## Buses and harness runs
bus BUS_A[24..1]
bus BUS_D[31..0]
bus BUS_NBE[3..0]
bus DAU_TFT_BLUE[4..0]
bus DAU_TFT_CL[3..1]
bus DAU_TFT_GREEN[5..0]
bus DAU_TFT_RED[4..0]
bus DIP[7..0]
bus EXTEND_A[49..0]
bus EXTEND_B[49..0]
bus EXTEND_C[49..0]
bus FPGA_ID[3..0]
bus FPGA_M[2..0]
bus IO[35..0]
bus LED[7..0]
bus SRAM1_A[18..0]
bus SRAM1_D[15..0]
bus SRAM2_A[18..0]
bus SRAM2_D[15..0]
bus SW[4..0]

## Layout directives
net class CLKS: BUS_SDRAM_CLK, IO18, IO19, NEXUS_TCK

## Notes on the sheet
- Only Input Only Pins Here
  Do not swap into other Banks!!
- DAUGHTER BOARD I/O
- JTAG
- PROGRAM
- (near NT2) FPGA_ID = 0x0
- (near NT2) (Xilinx)
- SPI BUS
- CLOCKS
- HOST PERIPHERALS
- UPDATED
- DAUGHTER BOARD MEMORY RESOURCES
- ONE-WIRE CONNECTIONS
- TFT LCD DISPLAY INTERFACE
- Project Title
- Sheet Title
- Size:
- Date:
- File:
- A2
- Assy:
- Time:
- Revision:
- Sheet
- of
- (in symbol D-241-0013, part A) BANK 0
- (in symbol D-241-0013, part B) BANK 1
- (in symbol D-241-0013, part C) BANK 2
- (in symbol D-241-0013, part D) BANK 3

## Library data of the parts
NT2-NT6 NT8 = D-002-0002: Net-Tie, Surface Mount, 2 x 0.4mm x 0.2mm SMT Pads - For 0.2mm Track; Status: Production; Category: Net-Tie
R1-R4 = D-100-0088: Resistor, 4K7 1% 0402 (1005); Power Rating: 63 mW; Resistance: 4.7 K; Mounting Technology: Surface Mount; Status: Production; Tolerance: 1 %; Category: Resistor
R8-R10 R12 R14 R18 R20 R22-R24 = D-100-0131: Resistor, 100R 1% 0402 (1005); Power Rating: 63 mW; Mounting Technology: Surface Mount; Resistance: 100 R; Status: Production; Tolerance: 1 %; Category: Resistor
R25 = D-100-0111: Resistor, 270R 1% 0402 (1005); Power Rating: 63 mW; Mounting Technology: Surface Mount; Resistance: 270 R; Status: Production; Tolerance: 1 %; Category: Resistor
U1 = D-241-0013: FPGA, Xilinx Spartan 3A-DSP-1800 FG676; Supply Voltage: mV; Mounting Technology: Surface Mount; Status: Unreleased; Technology: None; Category: IC-FPGA
U3 = D-205-0001: SN74LVC1G04DBV, Single Inverter Gate, 1.65-V to 5.5-V; Mounting Technology: Surface Mount; Status: Production; Category: IC-Logic